# EAGLE design SNES-1Chip_MR_QID (EAGLE 7.5.0)
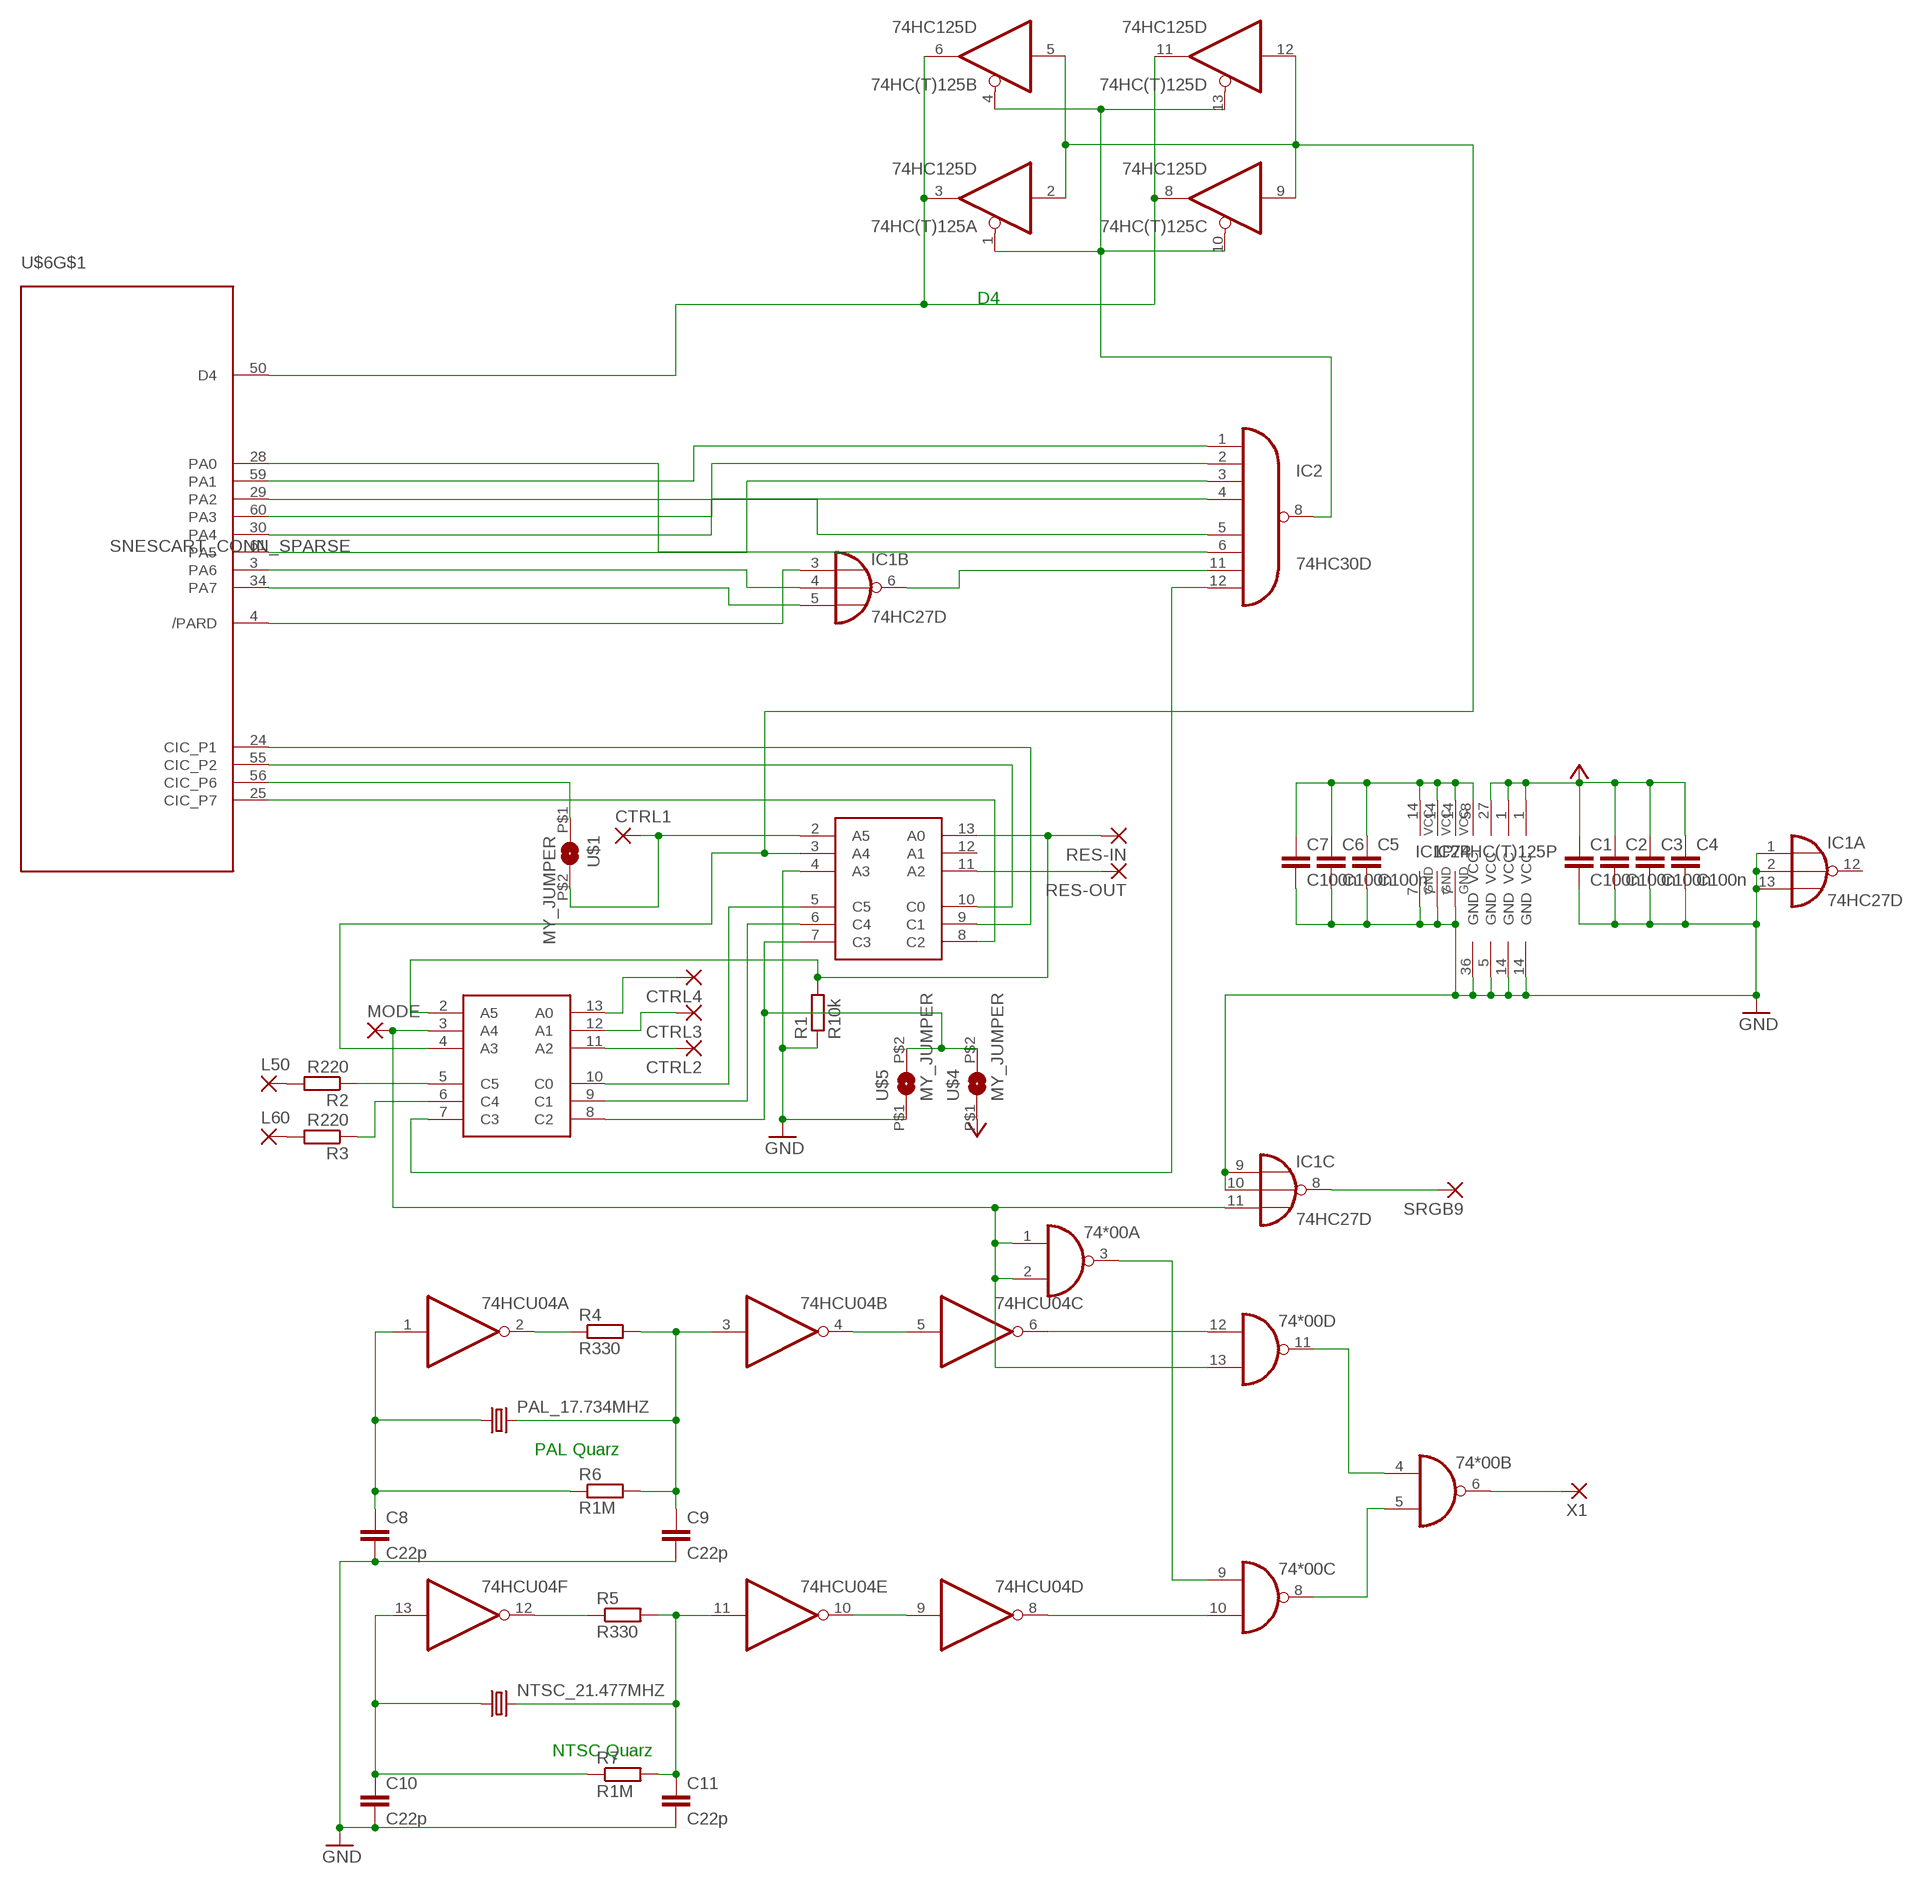
[diagram p0: schematic, sheet 1]

## Parts
74*00  7400D  [SO14]
74HC(T)125  74HC125D  [SO14]
74HCU04  74HC04D  [SO14]
C1  C100n  C0805  [Z0805]
C2  C100n  C0805  [Z0805]
C3  C100n  C0805  [Z0805]
C4  C100n  C0805  [Z0805]
C5  C100n  C0805  [Z0805]
C6  C100n  C0805  [Z0805]
C7  C100n  C0805  [Z0805]
C8  C22p  C0805  [Z0805]
C9  C22p  C0805  [Z0805]
C10  C22p  C0805  [Z0805]
C11  C22p  C0805  [Z0805]
CTRL1  SMD2  [SMD1,27-2,54]
CTRL2  SMD2  [SMD1,27-2,54]
CTRL3  SMD2  [SMD1,27-2,54]
CTRL4  SMD2  [SMD1,27-2,54]
IC1  74HC27D  [SO14]
IC2  74HC30D  [SO14]
L50  SMD2  [SMD1,27-2,54]
L60  SMD2  [SMD1,27-2,54]
MODE  SMD2  [SMD1,27-2,54]
NTSC_21.477MHZ  CRYSTALHC49UP  [HC49UP]
PAL_17.734MHZ  CRYSTALHC49UP  [HC49UP]
R1  R10k  R0805  [Z0805]
R2  R220  R0805  [Z0805]
R3  R220  R0805  [Z0805]
R4  R330  R0805  [Z0805]
R5  R330  R0805  [Z0805]
R6  R1M  R0805  [Z0805]
R7  R1M  R0805  [Z0805]
RES-IN  SMD2  [SMD1,27-2,54]
RES-OUT  SMD2  [SMD1,27-2,54]
SRGB9  SMD2  [SMD1,27-2,54]
U$1  MY_JUMPER  [MYJUMP]
U$2  PIC16F630_SIMPLE  [PIC16F630]
U$3  PIC16F630_SIMPLE  [PIC16F630]
U$4  MY_JUMPER  [MYJUMP]
U$5  MY_JUMPER  [MYJUMP]
U$6  SNESCART_CONN_SPARSE  [SNESCART_CONN_SPARSE]
X1  SMD2  [SMD1,27-2,54]

## Nets
GND: 74HC(T)125.7(P:GND) C1.2 C2.2 C3.2 C4.2 C5.2 C6.2 C7.2 C8.2 C9.2 C10.2 C11.2 IC1.1(A:I0) IC1.2(A:I1) IC1.7(P:GND) IC1.9(C:I0) IC1.10(C:I1) IC1.13(A:I2) IC2.7(GND) R1.1 U$2.4(A3) U$2.14(GND) U$3.14(GND) U$5.P$1 U$6.5(GND) U$6.36(GND)
N$1: IC1.8(C:O) SRGB9.1(P)
N$2: 74HC(T)125.1(A:OE) 74HC(T)125.4(B:OE) 74HC(T)125.10(C:OE) 74HC(T)125.13(D:OE) IC2.8(O)
N$3: RES-OUT.1(P) U$2.11(A2)
N$4: IC2.3(I2) U$6.61(PA5)
N$5: IC2.2(I1) U$6.60(PA3)
N$6: IC1.3(B:I0) U$6.4(/PARD)
N$7: IC1.4(B:I1) U$6.3(PA6)
N$8: IC1.6(B:O) IC2.11(I6)
N$9: IC2.6(I5) U$6.28(PA0)
N$10: R1.2 RES-IN.1(P) U$2.13(A0) U$3.2(A5)
N$11: L50.1(P) R2.2
N$12: R2.1 U$3.5(C5)
N$13: R3.1 U$3.6(C4)
N$14: 74*00.1(A:I0) 74*00.2(A:I1) 74*00.13(D:I1) IC1.11(C:I2) MODE.1(P) U$3.3(A4)
N$15: L60.1(P) R3.2
N$16: IC1.5(B:I2) U$6.34(PA7)
N$17: IC2.12(I7) U$3.7(C3)
N$18: U$1.P$1 U$6.56(CIC_P6)
N$19: U$2.5(C5) U$3.10(C0)
N$20: IC2.1(I0) U$6.59(PA1)
N$21: IC2.5(I4) U$6.29(PA2)
N$22: IC2.4(I3) U$6.30(PA4)
N$26: 74*00.12(D:I0) 74HCU04.6(C:O)
N$27: 74HCU04.1(A:I) C8.1 PAL_17.734MHZ.1 R6.1
N$28: 74HCU04.3(B:I) C9.1 PAL_17.734MHZ.2 R4.2 R6.2
N$29: 74HCU04.13(F:I) C10.1 NTSC_21.477MHZ.1 R7.1
N$30: 74HCU04.11(E:I) C11.1 NTSC_21.477MHZ.2 R5.2 R7.2
N$31: 74*00.5(B:I1) 74*00.8(C:O)
N$32: 74*00.4(B:I0) 74*00.11(D:O)
N$33: CTRL2.1(P) U$3.11(A2)
N$34: CTRL3.1(P) U$3.12(A1)
N$35: 74*00.3(A:O) 74*00.9(C:I0)
N$36: 74*00.6(B:O) X1.1(P)
N$37: 74HCU04.2(A:O) R4.1
N$38: 74HCU04.4(B:O) 74HCU04.5(C:I)
N$39: CTRL1.1(P) U$1.P$2 U$2.2(A5)
N$41: 74*00.10(C:I1) 74HCU04.8(D:O)
N$42: 74HC(T)125.3(A:O) 74HC(T)125.6(B:O) 74HC(T)125.8(C:O) 74HC(T)125.11(D:O) U$6.50(D4)
N$44: 74HCU04.9(D:I) 74HCU04.10(E:O)
N$46: CTRL4.1(P) U$3.13(A0)
N$48: U$2.10(C0) U$6.55(CIC_P2)
N$49: U$2.9(C1) U$6.24(CIC_P1)
N$50: 74HCU04.12(F:O) R5.1
N$51: U$2.8(C2) U$6.25(CIC_P7)
N$52: U$2.6(C4) U$3.9(C1)
N$53: U$2.7(C3) U$3.8(C2) U$4.P$2 U$5.P$2
UIGR: 74HC(T)125.2(A:I) 74HC(T)125.5(B:I) 74HC(T)125.9(C:I) 74HC(T)125.12(D:I) U$2.3(A4) U$3.4(A3)
VCC: C1.1 C2.1 C3.1 C4.1 U$2.1(VCC) U$3.1(VCC) U$4.P$1 U$6.27(VCC)
VCC_2: 74HC(T)125.14(P:VCC) C5.1 C6.1 C7.1 IC1.14(P:VCC) IC2.14(VCC) U$6.58(VCC)
Unconnected: IC1.12(A:O) U$2.12(A1)

## Notes on the sheet
- D4
- PAL Quarz
- NTSC Quarz

## Power pins joined to a net without a drawn wire
GND: 74*00.7(P:GND) 74HCU04.7(P:GND)
VCC: 74*00.14(P:VCC) 74HCU04.14(P:VCC)

## Library data of the parts
74*00 = 74xx-eu:74*00: Quad 2-input NAND gate
74HC(T)125 = 74xx-eu:74*125: Quad bus BUFFER, 3-state
74HCU04 = 74xx-eu:74*04: Hex INVERTER
C1-C11 = snescart:C0805
CTRL1-CTRL4 L50 L60 MODE RES-IN RES-OUT SRGB9 X1 = wirepad:SMD2: SMD PAD
IC1 = 74xx-eu:74*27: Triple 3-input NOR gate
IC2 = 74xx-eu:74*30: 8-input NAND gate
NTSC_21.477MHZ PAL_17.734MHZ = crystal:CRYSTAL: CRYSTAL; OC_FARNELL: unknown; OC_NEWARK: unknown
R1-R7 = snescart:R0805
U$1 U$4 U$5 = snescart:MY_JUMPER
U$2 U$3 = snescart:PIC16F630_SIMPLE
U$6 = snes_div:SNESCART_CONN_SPARSE

## Board
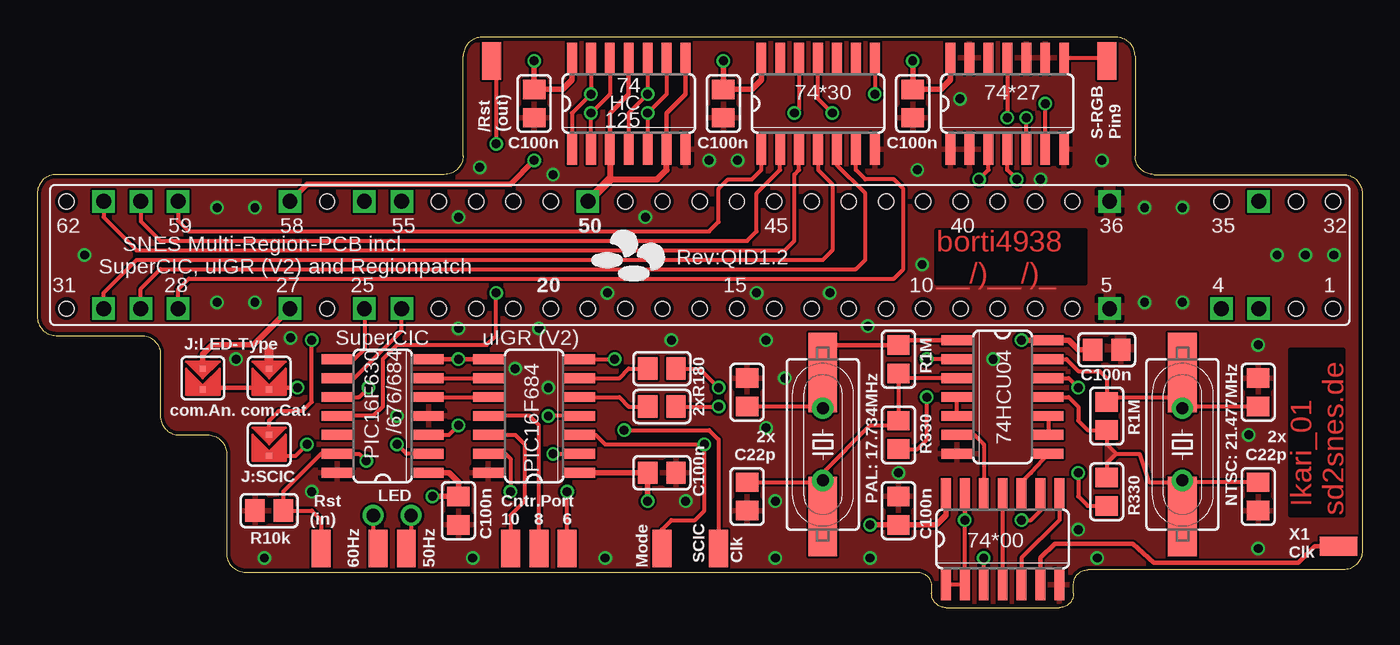
[diagram p1: board, top side]
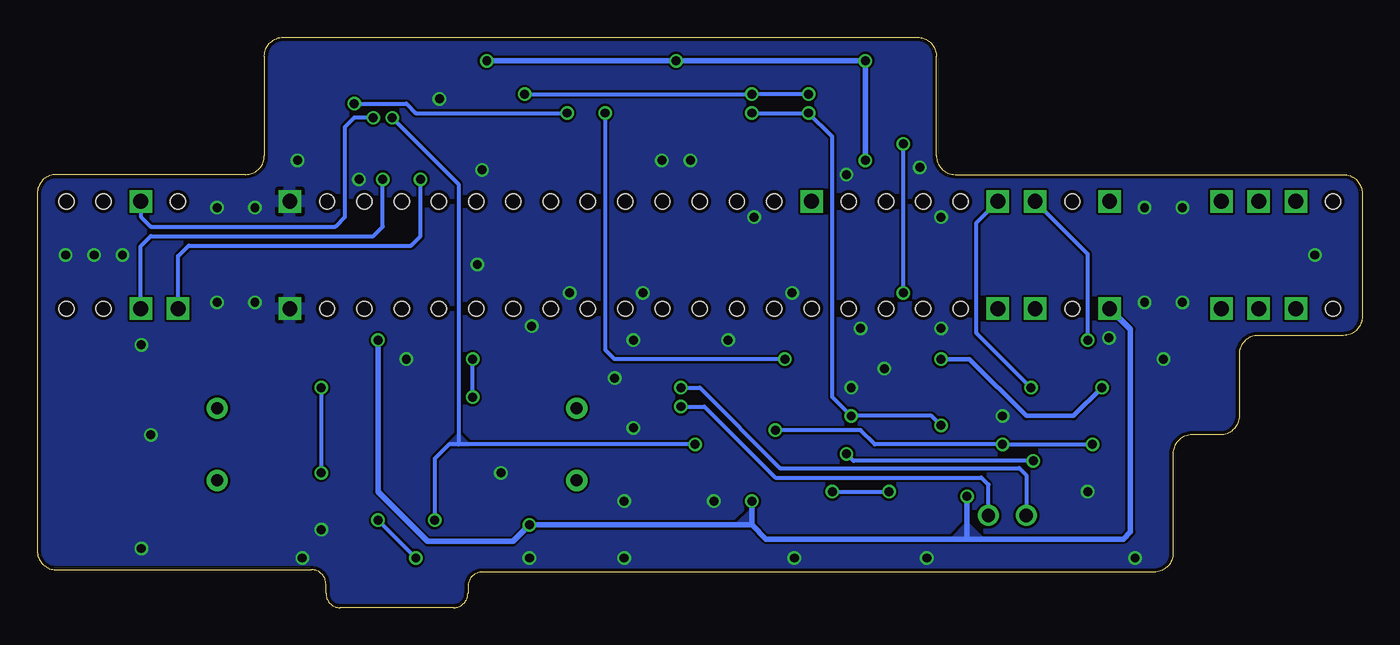
[diagram p2: board, bottom side, seen from below]

Size 88.9 x 38.26 mm. Coordinates in mm from the lower left corner, seen from the top.
Outline: 60.01,0.95 60.01,1.43 arc90 59.05,2.38 13.97,2.38 arc-90 12.7,3.65 12.7,10.32 arc90 11.43,11.59 9.53,11.59 arc-90 8.26,12.86 8.26,16.99 arc90 6.99,18.26 1.27,18.26 arc-90 0,19.53 0,27.78 arc-90 1.27,29.05 27.3,29.05 arc90 28.57,30.32 28.57,36.99 arc-90 29.84,38.26 72.39,38.26 arc-90 73.66,36.99 73.66,30.32 arc90 74.93,29.05 87.63,29.05 arc-90 88.9,27.78 88.9,3.81 arc-90 87.63,2.54 70.48,2.54 arc90 69.53,1.59 69.53,0.95 arc-90 68.58,0 60.96,0
Outline: 60.96,0 arc-90 60.01,0.95
Outline: 60.96,0 arc-90 60.01,0.95
Copper layers (1*16): Top 0.035mm / dielectric 1.5mm / Bottom 0.035mm
Design rules "ITEADstudio_DRC": minimum track width 6mil, minimum drill 12mil, track to track 6mil, track to pad 6mil, pad to pad 6mil, via to via 6mil, smd to smd 0mil, copper to edge 10mil, drill to drill 10mil, minimum pad ring 10mil, minimum via ring 6mil, stop-mask expansion 2mil, vias tented up to drill 30mil, thermal gap 10mil
tRestrict: 3 lines

### Footprints (pad centres in the part's own frame; a part is rotated, then mirrored left to right if it is on the bottom)
SO14 = smd 0.66 x 2.032: 1 -3.81,-3.073; 2 -2.54,-3.073; 3 -1.27,-3.073; 4 0,-3.073; 5 1.27,-3.073; 6 2.54,-3.073; 7 3.81,-3.073; 8 3.81,3.073; 9 2.54,3.073; 10 1.27,3.073; 11 0,3.073; 12 -1.27,3.073; 13 -2.54,3.073; 14 -3.81,3.073
Z0805 = smd 1.3 x 1.5: 1 -0.95,0; 2 0.95,0
SMD1,27-2,54 = smd 1.27 x 2.54: 1 0,0
HC49UP = smd 5.334 x 1.93: 1 -4.826,0; 2 4.826,0
MYJUMP = smd 0.406 x 0.406: P$1 -0.635,0; P$2 0.765,0
PIC16F630 = smd 0.66 x 2.032: 1 -3.81,-3.073; 2 -2.54,-3.073; 3 -1.27,-3.073; 4 0,-3.073; 5 1.27,-3.073; 6 2.54,-3.073; 7 3.81,-3.073; 8 3.81,3.073; 9 2.54,3.073; 10 1.27,3.073; 11 0,3.073; 12 -1.27,3.073; 13 -2.54,3.073; 14 -3.81,3.073
SNESCART_CONN_SPARSE = drill 1 square: 3 -3.6,-37.5; 4 -3.6,-35; 5 -3.6,-27.5; 24 -3.6,20; 25 -3.6,22.5; 27 -3.6,27.5; 28 -3.6,35; 29 -3.6,37.5; 30 -3.6,40; 34 3.6,-37.5; 36 3.6,-27.5; 50 3.6,7.5; 55 3.6,20; 56 3.6,22.5; 58 3.6,27.5; 59 3.6,35; 60 3.6,37.5; 61 3.6,40 | hole 1: -3.6,-42.5; -3.6,-40; -3.6,-25; -3.6,-22.5; -3.6,-20; -3.6,-17.5; -3.6,-15; -3.6,-12.5; -3.6,-10; -3.6,-7.5; -3.6,-5; -3.6,-2.5; -3.6,0; -3.6,2.5; -3.6,5; -3.6,7.5; -3.6,10; -3.6,12.5; -3.6,15; -3.6,17.5; -3.6,25; -3.6,42.5; 3.6,42.5; 3.6,25; 3.6,17.5; 3.6,15; 3.6,12.5; 3.6,10; 3.6,5; 3.6,2.5; 3.6,0; 3.6,-2.5; 3.6,-5; 3.6,-7.5; 3.6,-10; 3.6,-12.5; 3.6,-15; 3.6,-17.5; 3.6,-20; 3.6,-22.5; 3.6,-25; 3.6,-35; 3.6,-40; 3.6,-42.5

### Placement (x,y rotation side)
74*00  64.77,4.6 0 top
74HC(T)125  39.69,33.81 0 top
74HCU04  64.77,14.13 270 top
C1  41.91,9.05 0 top
C2  28.26,6.51 270 top
C3  57.78,6.51 90 top
C4  71.76,17.3 0 top
C5  33.34,33.81 270 top
C6  46.04,33.81 270 top
C7  58.74,33.81 270 top
C8  47.62,14.45 90 top
C9  47.62,7.46 270 top
C10  81.92,14.45 90 top
C11  81.92,7.46 270 top
CTRL1  45.72,3.97 0 top
CTRL2  33.65,3.97 0 top
CTRL3  31.75,3.97 0 top
CTRL4  35.56,3.97 0 top
IC1  65.09,33.81 0 top
IC2  52.39,33.81 0 top
L50  24.77,3.97 0 top
L60  22.86,3.97 0 top
MODE  41.91,3.97 0 top
NTSC_21.477MHZ  76.84,10.95 270 top
PAL_17.734MHZ  52.7,10.95 270 top
R1  15.56,6.51 0 top
R2  41.91,13.49 0 top
R3  41.91,16.03 0 top
R4  57.78,11.59 90 top
R5  71.76,7.78 90 top
R6  57.78,16.67 270 top
R7  71.76,12.86 270 top
RES-IN  19.05,3.97 0 top
RES-OUT  30.48,36.67 180 top
SRGB9  71.76,36.67 0 top
U$1  15.56,10.95 270 top
U$2  23.18,12.86 90 top
U$3  33.34,12.86 90 top
U$4  11.11,15.4 270 top
U$5  15.56,15.4 270 top
U$6  44.45,23.65 90 top
X1  87.31,4.13 270 top

### Tracks (layer width: path | path; a pad name or v marks a point on that pad's centre or on a via)
GND  (via drill 0.6)
  Top 0.61: U$5.P$1 15.56,17.3
  other vias: 24.13,12.86 83.19,23.65 87,23.65 49.53,3.33 76.84,20.48 71.44,30 69.85,5.24 34.61,29.05 3.18,23.65 81.92,3.97 42.54,17.94 74.3,20.48 85.09,23.65 45.08,30 81.28,11.59 13.34,16.67 12.07,26.83 81.92,17.62 15.24,3.33 12.07,20.48 14.61,26.83 28.26,26.19 59.05,29.37 74.3,26.83 50.16,15.4 34.29,14.76 32.07,16.03 57.78,9.05 46.99,30 55.88,3.33 64.14,16.67 55.72,18.89 16.99,18.1 38.1,3.33 76.84,26.83 14.61,20.48 48.89,17.94 59.37,23.02 43.5,7.14 67.31,28.73 61.91,34.13 53.18,21.11 48.26,21.11 18.41,7.78 29.21,3.33 71.12,3.33 29.69,29.53 38.26,21.11 40.8,26.19 28.26,18.73 33.65,18.73 48.89,12.07 49.53,7.14
  pour Top (rank 2): -1.27,-4.29 90.17,-4.29 90.17,41.43 -1.27,41.43
  pour Bottom (rank 2): -1.27,41.43 90.17,41.43 90.17,-4.29 -1.27,-4.29
  pour Top: 70.48,28.73 73.66,28.73 73.66,17.78 70.48,17.78
  pour Bottom: 70.48,28.73 73.66,28.73 73.66,17.78 70.48,17.78
N$1
  Top 0.254: IC1.8 71.22,36.89 SRGB9.1
N$2  (via drill 0.6)
  Top 0.254: 74HC(T)125.13 v37.15,34.45 35.88,33.18 74HC(T)125.1 | 74HC(T)125.10 v40.96,34.45 39.69,33.18 74HC(T)125.4 | IC2.8 v56.2,34.45
  Bottom 0.254: v37.15,34.45 v40.96,34.45 v56.2,34.45
N$3  (via drill 0.6)
  Top 0.254: v30.8,21.11 30.8,18.26 30.16,17.62 24.13,17.62 23.18,16.67 23.18,13.49 22.54,12.86 U$2.11 | RES-OUT.1 30.8,36.35 v30.8,31.11
  Bottom 0.254: v30.8,21.11 v30.8,31.11
N$4
  Top 0.254: U$6.61 4.45,26.19 6.67,23.97 50.16,23.97 50.8,24.61 50.8,29.05 51.12,29.37 IC2.3
  Top 0.305: U$6.61
N$5
  Top 0.254: U$6.60 6.95,25.91 8.26,24.61 47.62,24.61 48.26,25.24 48.26,27.78 49.85,29.37 IC2.2
N$6  (via drill 0.6)
  Top 0.254: v63.18,28.73 63.82,29.37 IC1.3
  Bottom 0.254: U$6.4 79.45,23.58 78.74,24.29 63.82,24.29 63.18,24.92 v63.18,28.73
N$7  (via drill 0.6)
  Top 0.254: v65.72,28.73 65.09,29.37 IC1.4
  Bottom 0.254: U$6.3 81.95,24.25 81.28,24.92 66.36,24.92 65.72,25.56 v65.72,28.73
N$8  (via drill 0.6)
  Top 0.254: v53.34,33.18 52.39,34.13 IC2.11 | IC1.6 v67.63,33.81
  Bottom 0.254: v67.63,33.81 64.14,33.81 63.5,33.18 v53.34,33.18
N$9
  Top 0.254: U$6.28 9.45,21.36 10.16,22.07 57.47,22.07 58.1,22.7 58.1,28.1 57.47,28.73 55.56,28.73 54.93,29.37 IC2.6
N$10  (via drill 0.6)
  Top 0.254: RES-IN.1 19.05,5.87 18.41,6.51 R1.2 16.51,7.78 19.05,10.32 U$2.13 21.59,10.32 v22.07,9.84 | v34.61,10.32 U$3.2
  Bottom 0.254: v22.07,9.84 34.13,9.84 v34.61,10.32
N$11  (via drill 0.6, 0.9 pad 1.42)
  Top 0.254: R2.2 v45.72,13.49 | v25.08,6.19 25.08,4.29 L50.1
  Bottom 0.254: v45.72,13.49 44.13,13.49 39.37,8.73 25.56,8.73 25.08,8.25 v25.08,6.19
N$12
  Top 0.254: U$3.5 39.05,14.13 39.69,13.49 R2.1
N$13
  Top 0.254: U$3.6 39.05,15.4 39.69,16.03 R3.1
N$14  (via drill 0.6)
  Top 0.254: U$3.3 37.46,11.59 38.1,10.95 v44.77,10.95 44.77,6.51 44.13,5.87 42.54,5.87 41.91,5.24 MODE.1 | v62.23,5.87 74*00.13 74*00.2 74*00.1 | IC1.11 v65.09,32.86
  Bottom 0.254: v44.77,10.95 60.64,10.95 | v65.09,32.86 60.64,28.42 60.64,10.95 | 60.64,10.95 61.28,10.95 62.23,10 v62.23,5.87
  pour Bottom: 61.28,10.95 60.01,10.95 60.64,11.59
N$15  (via drill 0.6, 0.9 pad 1.42)
  Top 0.254: R3.2 44.45,16.03 v45.72,14.76 | v22.54,6.19 22.54,4.29 L60.1
  Bottom 0.254: v45.72,14.76 44.45,14.76 39.05,9.37 23.02,9.37 22.54,8.89 v22.54,6.19
N$16  (via drill 0.6)
  Top 0.254: IC1.5 v66.36,32.86
  Bottom 0.254: v66.36,32.86 67.63,32.86 68.26,32.23 68.26,26.19 68.9,25.56 81.28,25.56 81.95,26.23 U$6.34
N$17  (via drill 0.6)
  Top 0.254: U$3.7 v38.73,16.67 | IC2.12 51.12,33.5 v50.8,33.18
  Bottom 0.254: v38.73,16.67 50.16,16.67 50.8,17.3 v50.8,33.18
N$18  (via drill 0.6)
  Top 0.254: U$1.P$1 15.56,12.54 16.19,13.18 17.78,13.18 18.41,13.81 v18.41,17.94
  Bottom 0.254: v18.41,17.94 18.41,23.72 U$6.56
N$19
  Top 0.254: U$2.5 U$3.10
N$20
  Top 0.254: U$6.59 9.45,25.95 10.16,25.24 45.08,25.24 45.72,25.88 45.72,28.1 46.35,28.73 47.94,28.73 48.58,29.37 IC2.1
N$21
  Top 0.254: U$6.29 6.95,21.4 8.26,22.7 54.93,22.7 55.56,23.34 55.56,27.78 53.66,29.69 IC2.5
N$22
  Top 0.254: U$6.30 4.45,21.12 6.67,23.34 52.7,23.34 53.34,23.97 53.34,28.42 52.39,29.37 IC2.4
N$26
  Top 0.254: 74HCU04.6 62.87,11.59 63.5,10.95 74*00.12
N$27  (via drill 0.8 pad 1.42)
  Top 0.254: PAL_17.734MHZ.1 v52.7,13.37 52.7,13.5 C8.1
  Top 0.305: 74HCU04.1 57.78,17.94 R6.1 52.71,17.62 52.7,17.62 PAL_17.734MHZ.1
N$28  (via drill 0.8 pad 1.42)
  Top 0.254: 74HCU04.3 58.1,15.4 R6.2 R4.2 57.47,12.22 55.88,12.22 52.7,9.05 v52.7,8.53 52.7,8.41 | C9.1 52.7,8.41 | 52.7,8.41 PAL_17.734MHZ.2
N$29  (via drill 0.8 pad 1.42)
  Top 0.254: NTSC_21.477MHZ.1 76.84,14.76 | 76.84,14.76 v76.84,13.37 76.84,13.49 C10.1 | 76.84,14.76 76.2,14.13 72.08,14.13 R7.1 71.76,15.4 71.28,15.87 69.85,15.87 69.06,16.67 74HCU04.13
N$30  (via drill 0.8 pad 1.42)
  Top 0.254: 72.39,10.32 71.76,10.95 R7.2 70.48,11.91 69.85,12.54 69.85,13.49 69.22,14.13 74HCU04.11 | 72.39,10.32 71.76,9.68 R5.2 | 77.47,8.41 76.83,8.41 74.61,8.41 73.98,10.32 72.39,10.32 | NTSC_21.477MHZ.2 76.84,7.78 77.47,8.41 | C11.1 77.47,8.41 | v76.84,8.53 77.47,8.41
  pour Top: 71.76,9.68 71.76,10.95 72.39,10.32
N$31
  Top 0.254: 74*00.8 68.58,5.87 66.04,3.33 74*00.5
N$32
  Top 0.254: 74*00.11 74*00.4
N$33
  Top 0.254: CTRL2.1 33.65,12.22 33.02,12.86 U$3.11
N$34
  Top 0.254: U$3.12 32.07,11.59 32.7,10.95 32.7,7.14 31.75,6.19 CTRL3.1
N$35  (via drill 0.6)
  Top 0.254: 74*00.3 v63.5,3.33 | v66.04,5.87 66.67,5.87 67.31,6.51 74*00.9
  Bottom 0.254: v63.5,3.33 v66.04,5.87
N$36
  Top 0.305: 74*00.6 67.31,3.33 68.26,4.29 73.5,4.29 74.93,3.02 84.61,3.02 85.73,4.13 X1.1
N$37  (via drill 0.6)
  Top 0.254: R4.1 59.06,10.64 59.69,11.27 v59.69,14.13 | 74HCU04.2 v59.69,16.67
  Bottom 0.254: v59.69,14.13 v59.69,16.67
N$38
  Top 0.254: 74HCU04.5 74HCU04.4
N$39  (via drill 0.6)
  Top 0.254: U$2.2 24.77,10.32 v24.13,10.95 | U$1.P$2 17.33,10.19 v18.1,10.95 | v39.37,11.91 45.08,11.91 45.72,11.27 CTRL1.1
  Bottom 0.254: v18.1,10.95 v24.13,10.95 32.7,10.95 33.65,11.91 v39.37,11.91
N$41
  Top 0.254: 74*00.10 66.04,8.41 66.67,9.05 74HCU04.8
N$42
  Top 0.305: 74HC(T)125.3 38.42,33.18 39.69,34.45 74HC(T)125.11 | 74HC(T)125.6 42.23,33.18 43.5,34.45 74HC(T)125.8 43.5,36.67
  Top 0.406: 74HC(T)125.6 42.23,29.37 41.59,28.73 38.42,28.73 74HC(T)125.3
  Top 0.61: U$6.50 36.95,27.27 38.42,28.73
N$44
  Top 0.254: 74HCU04.10 74HCU04.9
N$46  (via drill 0.6)
  Top 0.254: U$3.13 31.43,10.32 31.75,10 v31.75,7.78 | CTRL4.1 v35.56,7.78
  Bottom 0.254: v35.56,7.78 v31.75,7.78
N$48  (via drill 0.6)
  Top 0.254: U$2.10 21.59,14.13 v22.23,14.76
  Bottom 0.254: U$6.55 25.88,25.83 25.88,18.41 v22.23,14.76
N$49
  Top 0.254: U$2.9 21.27,15.4 24.45,18.57 U$6.24
N$50  (via drill 0.6)
  Top 0.254: 74HCU04.12 69.22,15.4 v69.85,14.76 | v69.85,9.05 69.85,7.46 70.48,6.83 R5.1
  Bottom 0.254: v69.85,14.76 v69.85,9.05
N$51
  Top 0.254: U$6.25 21.95,17.35 21.27,16.67 U$2.8
N$52
  Top 0.254: U$2.6 U$3.9
N$53  (via drill 0.6)
  Top 0.305: U$2.7 v28.26,16.67 U$3.8 | v17.46,14.76 15.88,14.76 15.75,14.63 U$5.P$2 15.43,14.76 11.43,14.76 11.3,14.63 U$4.P$2
  Bottom 0.305: v17.46,14.76 19.37,12.86 22.54,12.86 26.35,16.67 v28.26,16.67
UIGR  (via drill 0.6)
  Top 0.254: U$3.4 v34.29,12.86 | 74HC(T)125.9 42.23,34.45 v40.96,33.18 74HC(T)125.5 | 74HC(T)125.2 v37.15,33.18 38.42,34.45 74HC(T)125.12 | U$2.3 27.62,11.59 v28.26,12.22
  Bottom 0.254: v28.26,12.22 28.89,12.86 v34.29,12.86 35.56,14.13 35.56,31.59 v37.15,33.18 v40.96,33.18
VCC  (via drill 0.6)
  Top 0.305: C3.1 | 60.96,6.83 60.96,7.14 74*00.14
  Top 0.356: U$3.1 C1.1 v40.96,7.15 | U$2.1 27.62,9.05 28.26,8.41 C2.1 26.67,7.46 v26.51,7.46 | v55.88,5.56 C3.1 | U$4.P$1 11.11,16.99 11.75,17.62 14.52,17.62 U$6.27 | C3.1 60.33,5.56 60.96,6.19 60.96,7.14 | C4.1 69.85,17.3 69.22,17.94 74HCU04.14 v66.04,17.94
  Bottom 0.305: 40.96,6.83 v40.96,7.15
  Bottom 0.356: U$6.27 15.56,18.66 15.56,5.08 16.03,4.6 26.51,4.6 | 40.96,5.56 v55.88,5.56 56.99,4.44 62.71,4.44 66.04,7.78 v66.04,17.94 | 26.51,4.6 40,4.6 40.96,5.56 | 40.96,6.83 40.96,5.56 | v26.51,7.46 26.51,4.6
  pour Bottom: 25.56,4.6 26.51,5.56 27.46,4.6
  pour Bottom: 40.96,5.56 41.91,5.56 40.96,6.51
VCC_2  (via drill 0.6)
  Top 0.305: U$6.58 16.95,27.27 | C7.1 | C5.1 | v33.34,36.67 | C6.1
  Top 0.356: 16.95,27.27 18.1,28.42 31.75,28.42 v33.34,30 | v58.74,36.67 C7.1 | IC1.14 61.28,35.4 60.64,34.77 C7.1 | IC2.14 48.58,35.4 47.94,34.77 C6.1 | 74HC(T)125.14 35.88,35.4 35.24,34.77 C5.1 v33.34,36.67 | C6.1 v46.04,36.67
  Bottom 0.356: v33.34,30 v33.34,36.67 v46.04,36.67 v58.74,36.67

### Text on the board
Top: borti4938 / __/)__/)_ | Ikari_01 / sd2snes.de
tNames: 74 / HC / 125 | 74*30 | 74*27 | /Rst / (out) | S-RGB / Pin9 | C100n | C100n | C100n | SNES Multi-Region-PCB incl. / SuperCIC, uIGR (V2) and Regionpatch | Rev:QID1.2 | J:LED-Type | SuperCIC | PIC16F630 / /676/684 | uIGR (V2) | NTSC: 21.477MHz | PAL: 17.734MHz | C100n | com.An. | com.Cat. | 2xR180 | 2x / C22p | 2x / C22p | J:SCIC | PIC16F684 | LED | Rst / (in) | Cntr.Port / 10 | 8 | 6 | C100n | C100n | X1 / Clk | 60Hz | 50Hz | Mode | SCIC | Clk
tStop: b | o | r | t | i | 4 | 9 | 3 | 8 | _ | _ | / | ) | _ | _ | / | ) | _ | e | 1 | d | . | 0 | s | _ | e | i | n | r | a | s | k | 2 | I | d | s